# EAGLE design PPT_controller_flight1 (EAGLE 9.2.1)
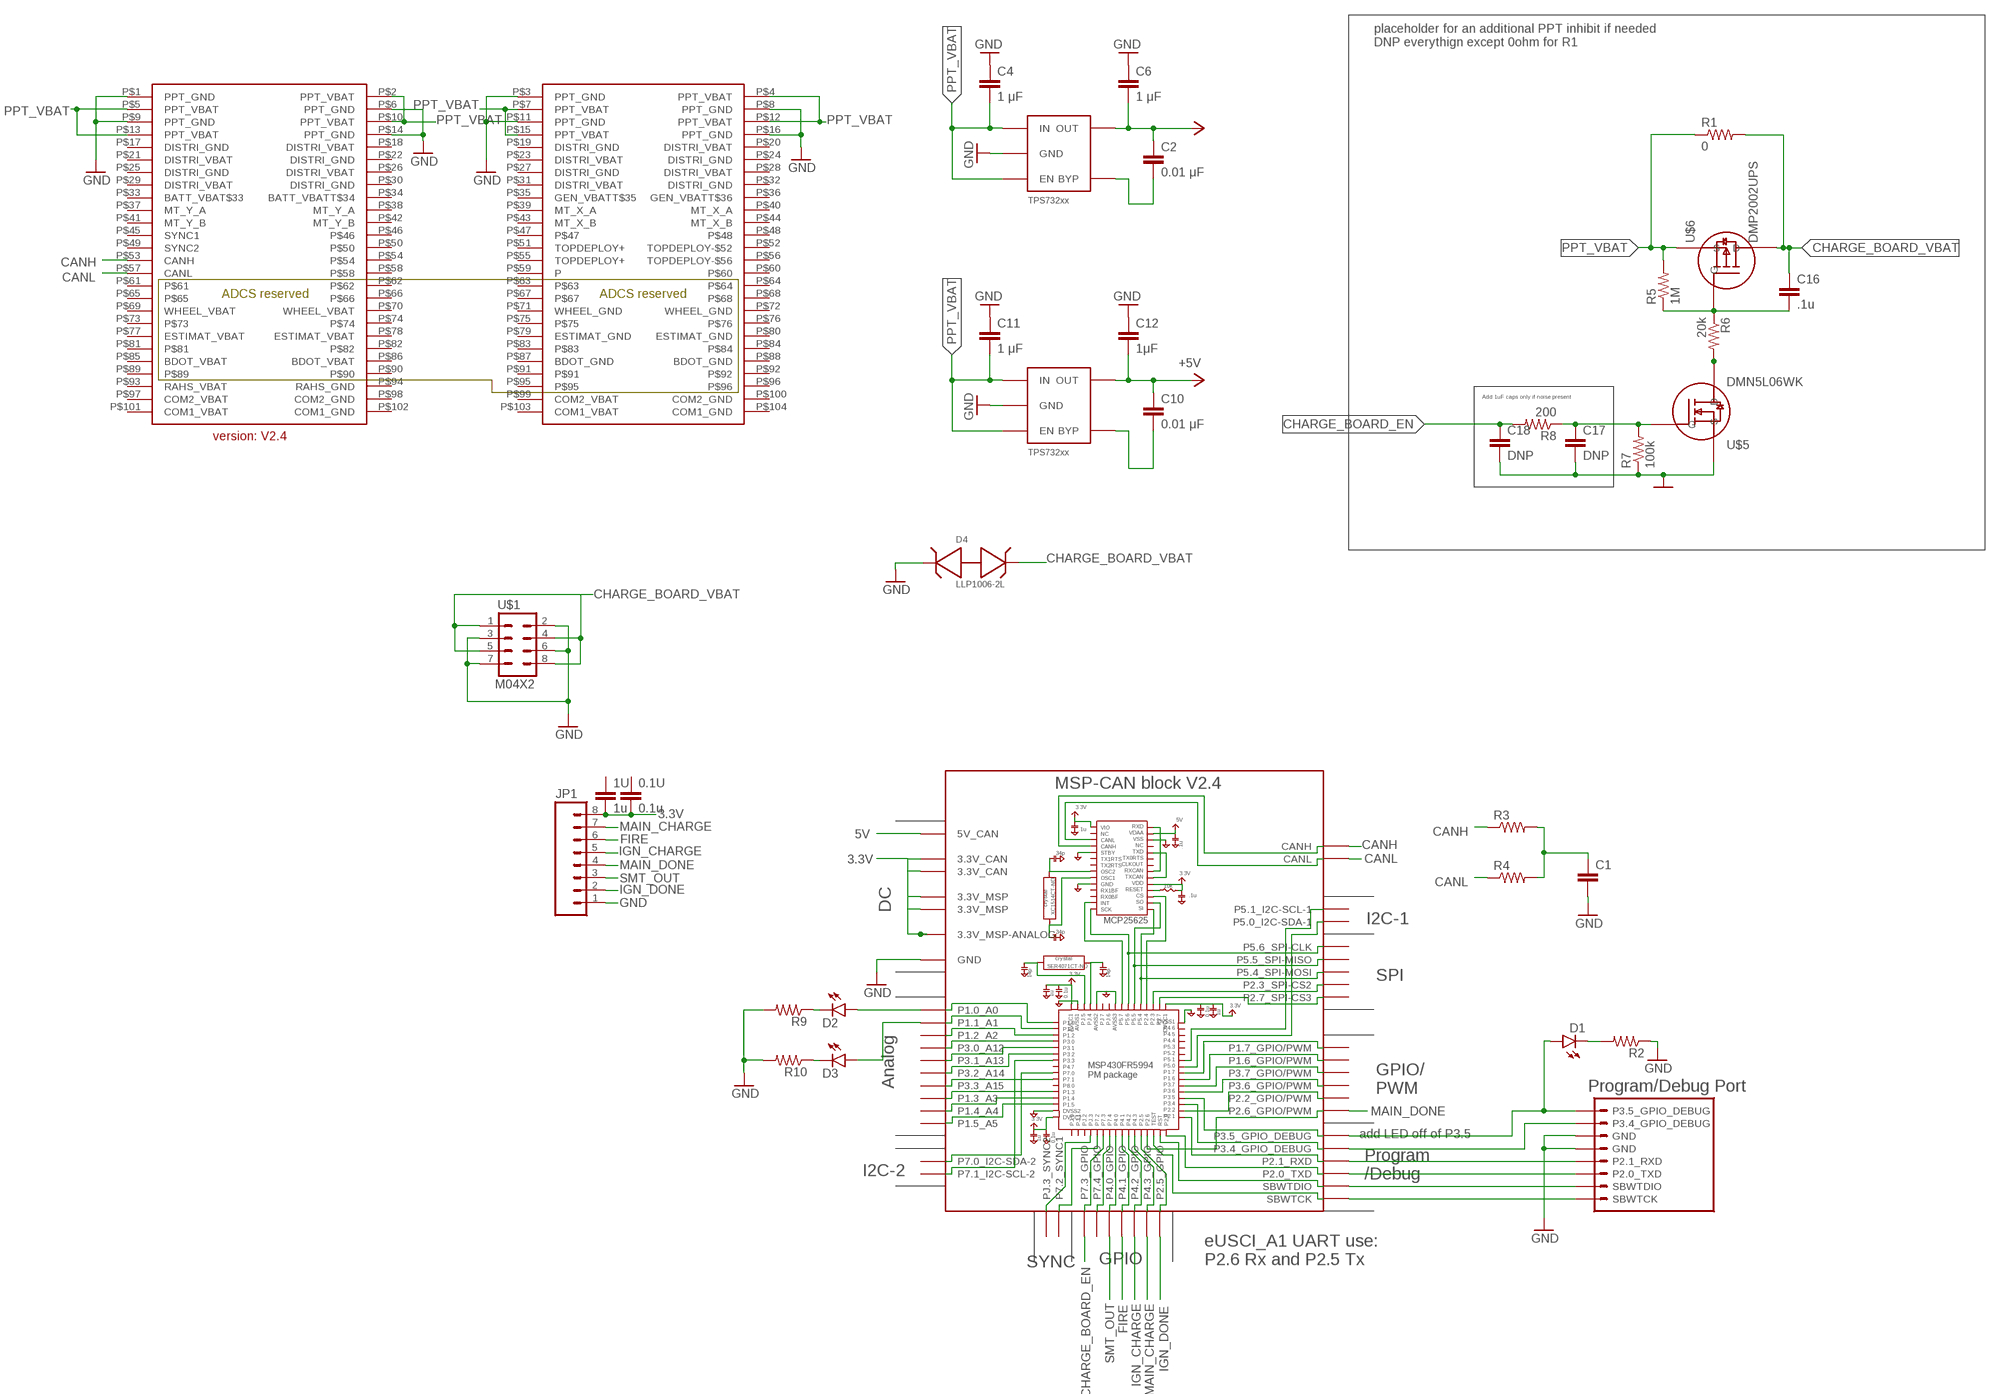
[diagram p0: schematic, sheet 1]

## Parts
0.1U  0.1u  CAPACITOR0805  [0805]
1U  1u  CAPACITOR0805  [0805]
BLK1  MSP-CAN_BLOCK  [MSP-CAN_BLOCK]
C1  CAPACITOR0805  [0805]
C2  0.01 μF  CAPACITOR0805  [0805]
C4  1 μF  CAPACITOR0805  [0805]
C6  1 μF  CAPACITOR0805  [0805]
C10  0.01 μF  CAPACITOR0805  [0805]
C11  1 μF  CAPACITOR0805  [0805]
C12  1μF  CAPACITOR0805  [0805]
C16  .1u  CAPACITOR0805  [0805]
C17  DNP  CAPACITOR0805  [0805]
C18  DNP  CAPACITOR0805  [0805]
D1  LED  [LED-1206]
D2  LED  [LED-1206]
D3  LED  [LED-1206]
D4  LLP1006-2L  [LLP1006-2L]
JP1  M08  [1X08_PIN1_NO_SILK]
R1  0  RESISTOR2010  [R2010]
R2  RESISTOR0805  [0805]
R3  RESISTOR0805  [0805]
R4  RESISTOR0805  [0805]
R5  1M  RESISTOR0805  [0805]
R6  20k  RESISTOR0805  [0805]
R7  100k  RESISTOR0805  [0805]
R8  200  RESISTOR0805  [0805]
R9  RESISTOR0805  [0805]
R10  RESISTOR0805  [0805]
U2  TPS732XX  [SOT-23-5]
U4  TPS732XX  [SOT-23-5]
U$1  M04X2  [2X4]
U$2  PC104_CONNECTOR  [PC104_CONNECTOR]
U$3  PROGRAM/DEBUG_PORT  [1X08_CONNECTOR]
U$5  DMN5L06WK  [SOT-323]
U$6  DMP2002UPS  [POWERDI5060-8]

## Nets
3.3V: 0.1U.2 1U.2 BLK1.3.3V@CAN1(3.3V_CAN) BLK1.3.3V@CAN2(3.3V_CAN) BLK1.3.3V@MSP1(3.3V_MSP) BLK1.3.3V@MSP2(3.3V_MSP) BLK1.3.3V_ANALOG@MSP2(3.3V_MSP-ANALOG) C2.1 C6.2 JP1.8 U2.P$5(OUT) ; supply symbol labelled +3V3
5V: BLK1.5V(5V_CAN) C10.1 C12.2 U4.P$5(OUT) ; supply symbol labelled +5V
CANH: BLK1.CANH R3.1 U$2.P$53(CANH)
CANL: BLK1.CANL R4.1 U$2.P$57(CANL)
CHARGE_BOARD_EN: BLK1.P7.3_GPIO C18.1 R8.2
CHARGE_BOARD_VBAT: C16.1 D4.P$2 R1.2 U$1.1 U$1.4 U$1.5 U$1.8 U$6.D1(D) U$6.D2(D) U$6.D3(D) U$6.D4(D) U$6.D5(D)
FIRE: BLK1.P4.1_GPIO JP1.6
GND: BLK1.GND@1(GND) BLK1.GND@2(GND) BLK1.GND@3(GND) BLK1.GND@4(GND) BLK1.GND@5(GND) BLK1.GND@7(GND) BLK1.GND@8(GND) BLK1.GND@9(GND) BLK1.GND@10(GND) BLK1.GND@11(GND) BLK1.GND@12(GND) BLK1.GND@13(GND) BLK1.GND@14(GND) BLK1.GND@15(GND) BLK1.GND@16(GND) BLK1.GND@17(GND) BLK1.GND@26(GND) C1.2 C4.1 C6.1 C11.1 C12.1 C17.2 C18.2 D4.P$1 JP1.1 R2.1 R7.1 R9.2 R10.2 U2.P$2(GND) U4.P$2(GND) U$1.2 U$1.3 U$1.6 U$1.7 U$2.P$1(PPT_GND) U$2.P$3(PPT_GND) U$2.P$6(PPT_GND) U$2.P$8(PPT_GND) U$2.P$9(PPT_GND) U$2.P$11(PPT_GND) U$2.P$14(PPT_GND) U$2.P$16(PPT_GND) U$3.5(GND) U$3.6(GND) U$5.2(S) ; supply symbol labelled DGND
IGN_CHARGE: BLK1.P4.2_GPIO JP1.5
IGN_DONE: BLK1.P2.5_GPIO JP1.2
LDO_3V3_BYP2: C2.2 U2.P$4(BYP)
LDO_5V_BYP2: C10.2 U4.P$4(BYP)
MAIN_CHARGE: BLK1.P4.3_GPIO JP1.7
MAIN_DONE: BLK1.P2.6_GPIO/PWM JP1.4
N$1: C16.2 R5.1 R6.1 U$6.G
N$2: C17.1 R7.2 R8.1 U$5.1(G)
N$3: BLK1.SBWTCK U$3.SBWTCK
N$4: BLK1.SBWTDIO U$3.2(SBWTDIO)
N$5: BLK1.P2.0_TXD U$3.3(P2.0_TXD)
N$6: R6.2 U$5.3(D)
N$7: BLK1.P2.1_RXD U$3.4(P2.1_RXD)
N$8: BLK1.P3.4_GPIO_DEBUG U$3.7(P3.4_GPIO_DEBUG)
N$9: BLK1.P3.5_GPIO_DEBUG D1.A U$3.8(P3.5_GPIO_DEBUG)
N$10: C1.1 R3.2 R4.2
N$11: D1.C R2.2
N$12: BLK1.P1.0_A0 D2.A
N$13: BLK1.P1.1_A1 D3.A
N$14: D3.C R10.1
N$15: D2.C R9.1
PPT_VBAT: C4.2 C11.2 R1.1 R5.2 U2.P$1(IN) U2.P$3(EN) U4.P$1(IN) U4.P$3(EN) U$2.P$2(PPT_VBAT) U$2.P$4(PPT_VBAT) U$2.P$5(PPT_VBAT) U$2.P$7(PPT_VBAT) U$2.P$10(PPT_VBAT) U$2.P$12(PPT_VBAT) U$2.P$13(PPT_VBAT) U$2.P$15(PPT_VBAT) U$6.S1(S) U$6.S2(S) U$6.S3(S)
SMT_OUT: BLK1.P4.0_GPIO JP1.3
Unconnected: 0.1U.1 1U.1 BLK1.P1.2_A2 BLK1.P1.3_A3 BLK1.P1.4_A4 BLK1.P1.5_A5 BLK1.P1.6_GPIO/PWM BLK1.P1.7_GPIO/PWM BLK1.P2.2_GPIO/PWM BLK1.P2.4_SPI-CS2(P2.3_SPI-CS2) BLK1.P2.7_SPI-CS3 BLK1.P3.0_A12 BLK1.P3.1_A13 BLK1.P3.2_A14 BLK1.P3.3_A15 BLK1.P3.6_GPIO/PWM BLK1.P3.7_GPIO/PWM BLK1.P5.0_I2C-SDA-1 BLK1.P5.1_I2C-SCL-1 BLK1.P5.4_SPI-MOSI BLK1.P5.5_SPI-MISO BLK1.P5.6_SPI-CLK BLK1.P7.0_I2C-SDA-2 BLK1.P7.1_I2C-SCL-2 BLK1.P7.2_SYNC1 BLK1.P7.4_GPIO BLK1.PJ.3_SYNC2 U$2.P$17(DISTRI_GND) U$2.P$18(DISTRI_VBAT) U$2.P$19(DISTRI_GND) U$2.P$20(DISTRI_VBAT) U$2.P$21(DISTRI_VBAT) U$2.P$22(DISTRI_GND) U$2.P$23(DISTRI_VBAT) U$2.P$24(DISTRI_GND) U$2.P$25(DISTRI_GND) U$2.P$26(DISTRI_VBAT) U$2.P$27(DISTRI_GND) U$2.P$28(DISTRI_VBAT) U$2.P$29(DISTRI_VBAT) U$2.P$30(DISTRI_GND) U$2.P$31(DISTRI_VBAT) U$2.P$32(DISTRI_GND) U$2.P$33(BATT_VBAT$33) U$2.P$34(BATT_VBATT$34) U$2.P$35(GEN_VBATT$35) U$2.P$36(GEN_VBATT$36) U$2.P$37(MT_Y_A) U$2.P$38(MT_Y_A) U$2.P$39(MT_X_A) U$2.P$40(MT_X_A) U$2.P$41(MT_Y_B) U$2.P$42(MT_Y_B) U$2.P$43(MT_X_B) U$2.P$44(MT_X_B) U$2.P$45(SYNC1) U$2.P$46 U$2.P$47 U$2.P$48 U$2.P$49(SYNC2) U$2.P$50 U$2.P$51(TOPDEPLOY+) U$2.P$52(TOPDEPLOY-$52) U$2.P$54 U$2.P$55(TOPDEPLOY+) U$2.P$56(TOPDEPLOY-$56) U$2.P$58 U$2.P$59(P) U$2.P$60 U$2.P$61 U$2.P$62 U$2.P$63 U$2.P$64 U$2.P$65 U$2.P$66 U$2.P$67 U$2.P$68 U$2.P$69(WHEEL_VBAT) U$2.P$70(WHEEL_VBAT) U$2.P$71(WHEEL_GND) U$2.P$72(WHEEL_GND) U$2.P$73 U$2.P$74 U$2.P$75 U$2.P$76 U$2.P$77(ESTIMAT_VBAT) U$2.P$78(ESTIMAT_VBAT) U$2.P$79(ESTIMAT_GND) U$2.P$80(ESTIMAT_GND) U$2.P$81 U$2.P$82 U$2.P$83 U$2.P$84 U$2.P$85(BDOT_VBAT) U$2.P$86(BDOT_VBAT) U$2.P$87(BDOT_GND) U$2.P$88(BDOT_GND) U$2.P$89 U$2.P$90 U$2.P$91 U$2.P$92 U$2.P$93(RAHS_VBAT) U$2.P$94(RAHS_GND) U$2.P$95 U$2.P$96 U$2.P$97(COM2_VBAT) U$2.P$98(COM2_GND) U$2.P$99(COM2_VBAT) U$2.P$100(COM2_GND) U$2.P$101(COM1_VBAT) U$2.P$102(COM1_GND) U$2.P$103(COM1_VBAT) U$2.P$104(COM1_GND)

## Notes on the sheet
- placeholder for an additional PPT inhibit if needed
  DNP everythign except 0ohm for R1
- Add 1uF caps only if noise present

## Library data of the parts
0.1U 1U C1 C2 C4 C6 C10-C12 C16-C18 = DubSat1 Components:CAPACITOR: Capacitor Standard 0603 ceramic capacitor, and 0.1" leaded capacitor.
BLK1 = DubSat1 Components:MSP-CAN_BLOCK
D1-D3 = DubSat1 Components:LED
D4 = DubSat1 Components:LLP1006-2L: A LLP1006-2L diode
JP1 = SparkFun-Connectors:M08: Header 8 Standard 8-pin 0.1" header. Use with straight break away headers (SKU : PRT-00116), right angle break away headers (PRT-00553), swiss pins (PRT-00743), machine pins (PRT-00117), and female headers (PRT-00115).
R1-R10 = DubSat1 Components:RESISTOR: Resistor Basic schematic elements and footprints for 0603, 1206, and PTH resistors.
U2 U4 = DubSat1 Components:TPS732XX
U$1 = SparkFun-Connectors:M04X2: .1" header, two rows of four.
U$2 = DubSat1 Components:PC104_CONNECTOR
U$3 = DubSat1 Components:PROGRAM/DEBUG_PORT
U$5 = DubSat1 Components:DMN5L06WK
U$6 = DubSat1 Components:DMP2002UPS

## Board
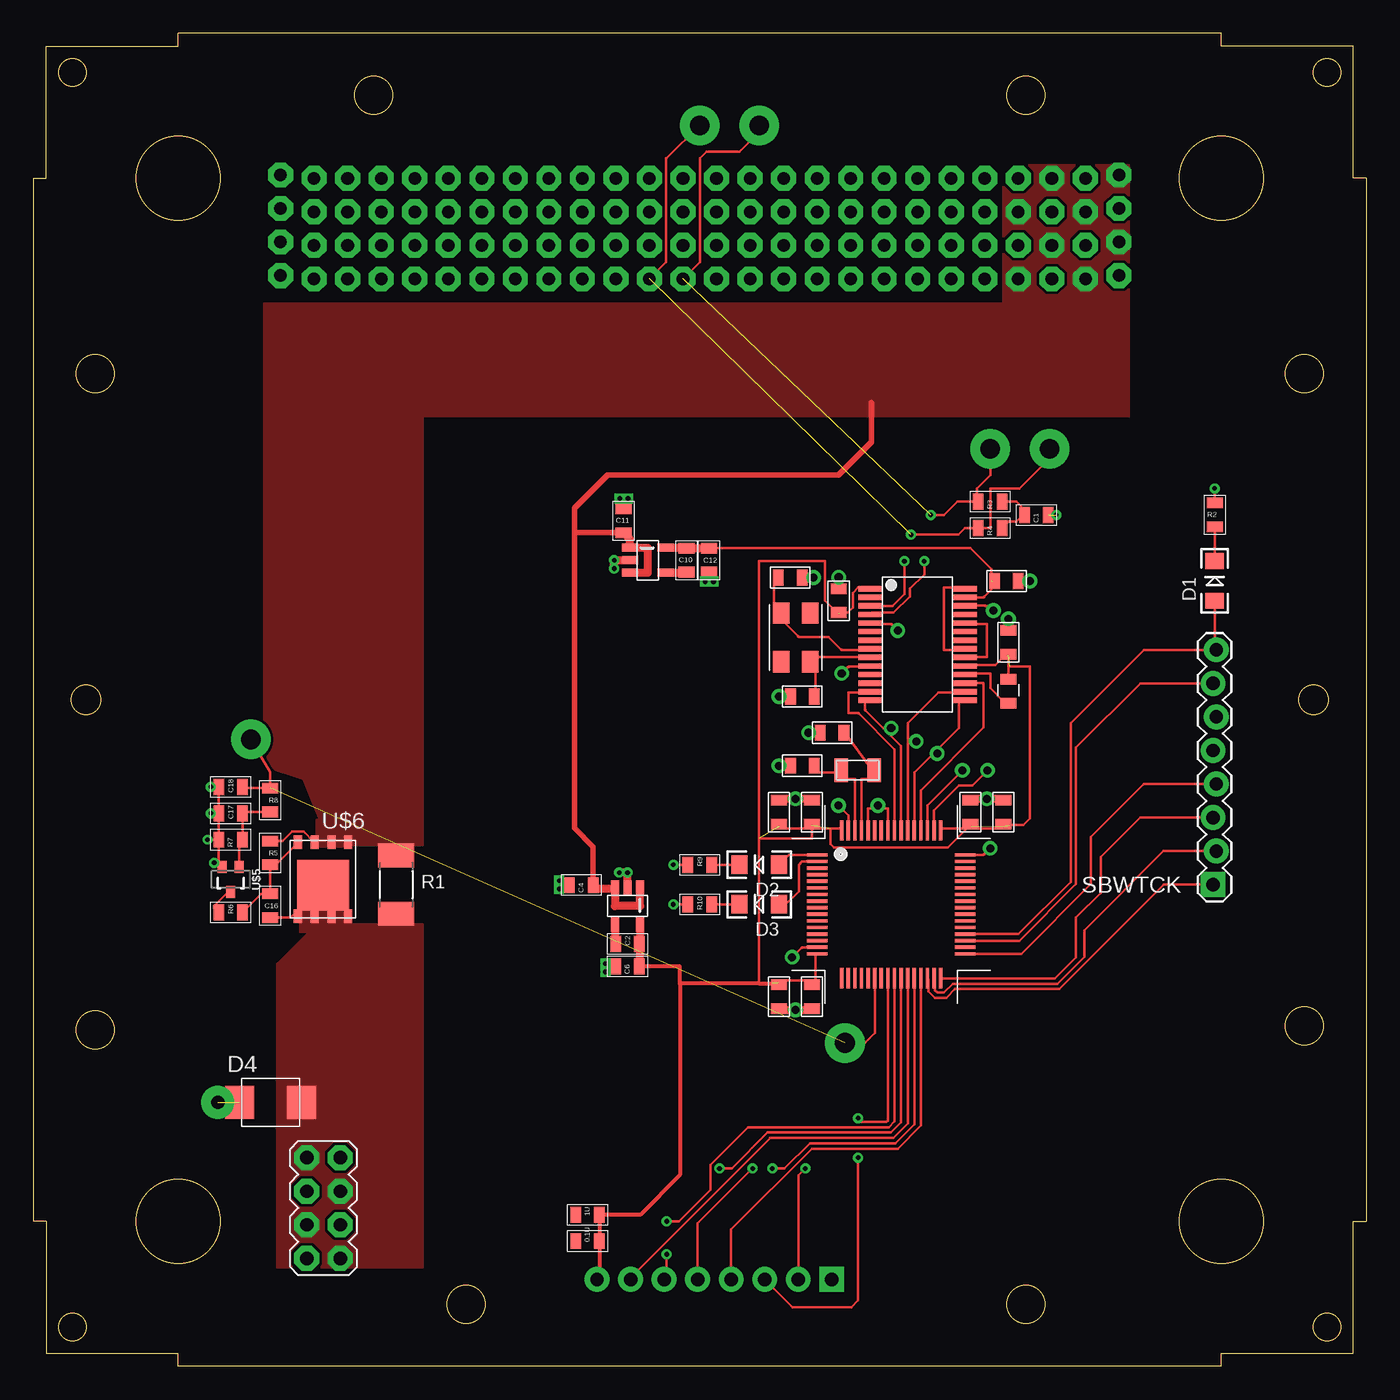
[diagram p1: board, top side]
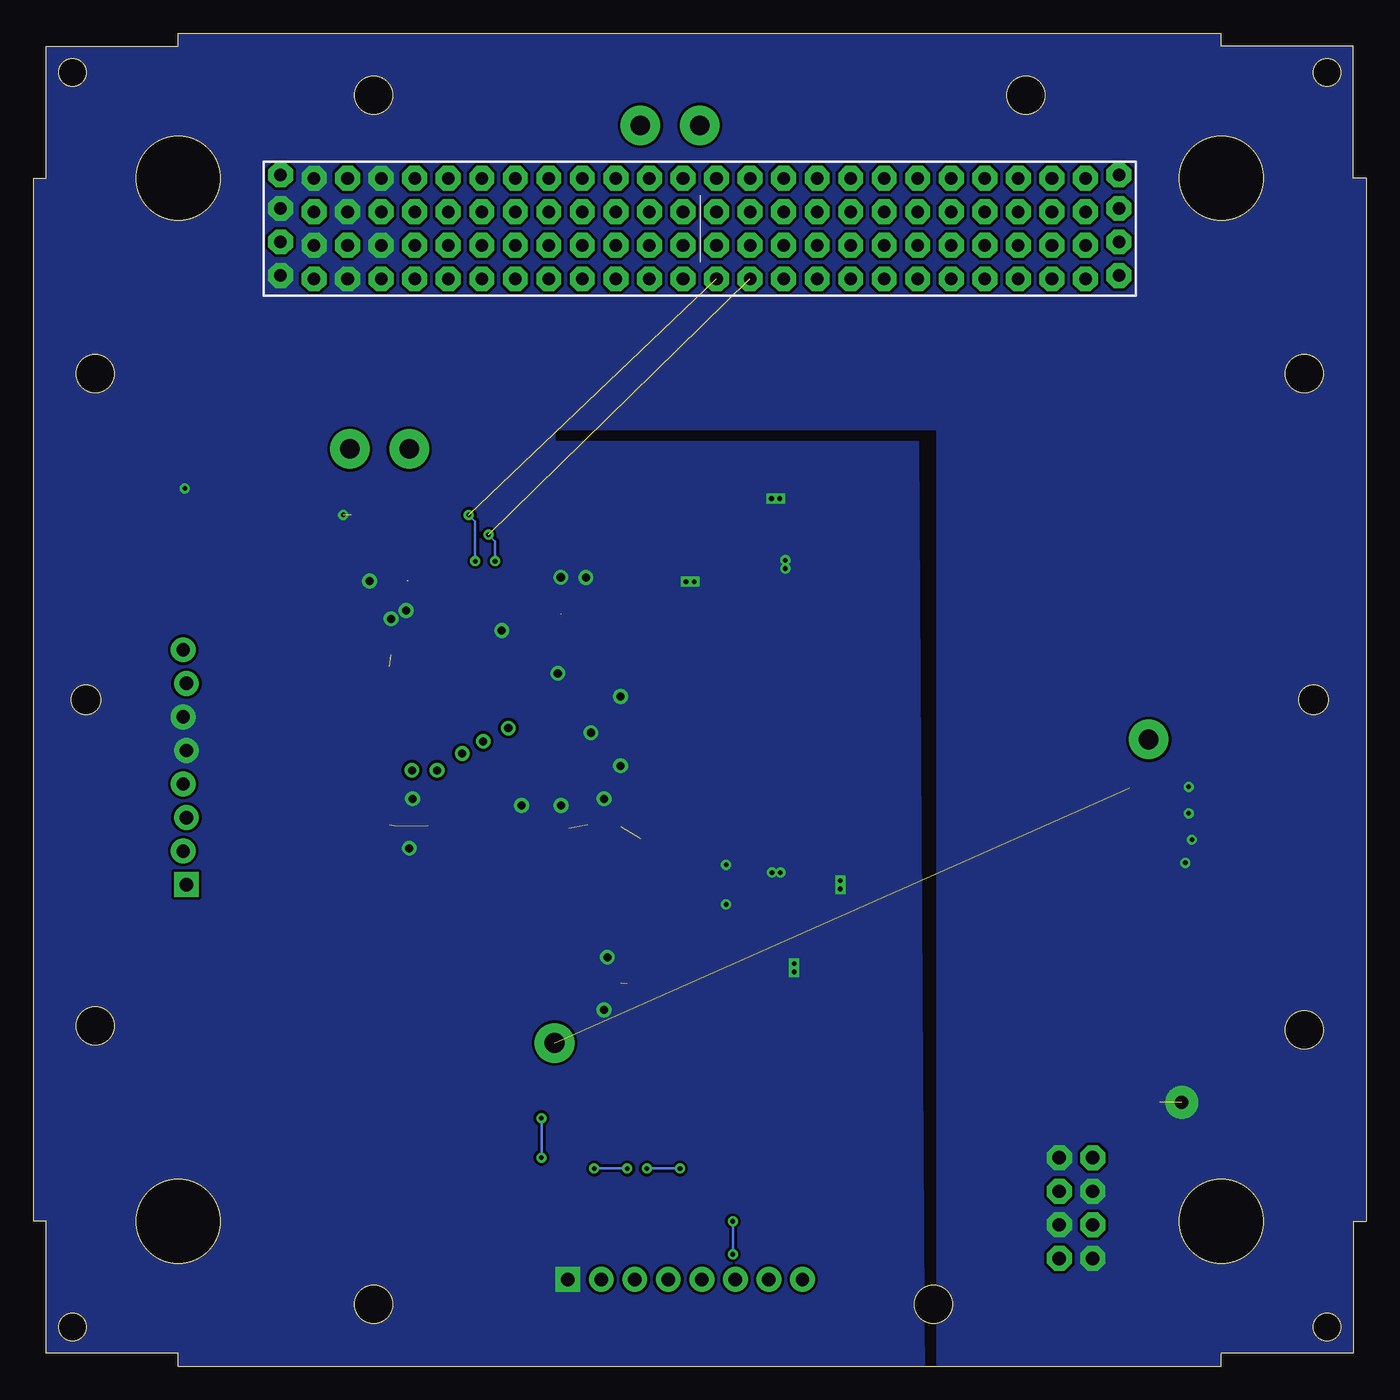
[diagram p2: board, bottom side, seen from below]

Size 101 x 101 mm. Coordinates in mm from the lower left corner, seen from the top.
Outline: 90,101 11,101 11,100 1,100 1,90 0,90 0,11 1,11 1,1 11,1 11,0 90,0 90,1 100,1 100,11 101,11 101,90 100,90 100,100 90,100 90,101
Outline: circle at 4.7,25.5 radius 1.45
Outline: circle at 32.8,4.7 radius 1.45
Outline: circle at 75.2,4.7 radius 1.45
Outline: circle at 96.3,25.8 radius 1.45
Outline: circle at 96.3,75.2 radius 1.45
Outline: circle at 75.2,96.3 radius 1.45
Outline: circle at 25.8,96.3 radius 1.45
Outline: circle at 4.7,75.2 radius 1.45
Outline: circle at 4,50.5 radius 1.13
Outline: circle at 97,50.5 radius 1.13
Outline: circle at 3,98 radius 1.05
Outline: circle at 3,3 radius 1.05
Outline: circle at 98,3 radius 1.05
Outline: circle at 98,98 radius 1.05
Outline: circle at 90,11 radius 3.17
Outline: circle at 11,11 radius 3.17
Outline: circle at 11,90 radius 3.17
Outline: circle at 90,90 radius 3.17
Copper layers (1*16): Top 0.035mm / dielectric 1.5mm / Bottom 0.035mm
Design rules "default *": minimum track width 6mil, minimum drill 0.35mm, track to track 8mil, track to pad 8mil, pad to pad 8mil, via to via 8mil, smd to smd 8mil, copper to edge 1mil, drill to drill 8mil, minimum pad ring 10mil, minimum via ring 8mil, stop-mask expansion 4mil, vias tented up to drill 0mil, thermal gap 10mil

### Footprints (pad centres in the part's own frame; a part is rotated, then mirrored left to right if it is on the bottom)
0805 = smd 0.8 x 1.2: 1 -0.9,0; 2 0.9,0
MSP-CAN_BLOCK = smd 1.2 x 0.8: 1 -6,6.08; 2 -6,7.88; 3 -8.5,6.08; 4 -8.5,7.88; 9 -8.5,-6.08; 10 -8.5,-7.88; 11 -6,-6.08; 12 -6,-7.88; 13 8.5,6.08; 14 8.5,7.88; 15 6,6.08; 16 6,7.88; 23 8.875,18.955; 24 8.875,20.755; 25 8.875,17.045; 26 8.875,15.245; 27 -3.975,22.105; 28 -3.975,23.905 | smd 1 x 0.25: 3.3V@CAN1 -3.975,22.025; 3.3V@CAN2 8.875,18.875; 3.3V@MSP1 8.501,5.884; 3.3V@MSP2 -8.533,-5.962; 3.3V_ANALOG@MSP2 -8.482,5.904 | smd 0.8 x 1.2: 5 -5.83,10.5; 6 -7.63,10.5; 7 -3.58,13; 8 -5.38,13; 17 -8.545,24.75; 18 -6.745,24.75; 19 -5.83,15.75; 20 -7.63,15.75; 21 7.83,24.5; 22 9.63,24.5 | smd 0.25 x 1: 5V 7.65,24.5 | smd 1.75 x 0.4: CANH -1.6,21.96; CANL -1.6,22.61; P$65 -1.6,23.91; P$66 -1.6,23.26; P$69 -1.6,21.31; P$70 -1.6,20.66; P$71 -1.6,20.01; P$72 -1.6,19.36; P$73 -1.6,18.71; P$74 -1.6,18.06; P$75 -1.6,17.41; P$76 -1.6,16.76; P$77 -1.6,16.11; P$78 -1.6,15.46; P$79 5.6,15.46; P$80 5.6,16.11; P$81 5.6,16.76; P$82 5.6,17.41; P$83 5.6,18.06; P$84 5.6,18.71; P$85 5.6,19.36; P$86 5.6,20.01; P$87 5.6,20.66; P$88 5.6,21.31; P$89 5.6,21.96; P$90 5.6,22.61; P$91 5.6,23.26; P$92 5.6,23.91 | drill 0.61: GND@1 -3.975,24.775; GND@2 -5.875,24.75; GND@3 -3.75,17.5; GND@4 0.5,20.75; GND@5 -8.5,15.75; GND@7 -8.5,10.5; GND@8 -7.25,8; GND@9 -4,7.5; GND@10 -1,7.5; GND@11 7.75,22.25; GND@12 10.5,24.5; GND@13 8.875,21.625; GND@14 7.25,8; GND@15 7.5,4.25; GND@16 -7.5,-4; GND@17 -7.25,-8; GND@26 -6.25,13; P2.4_SPI-CS2 5.397,10.16; P2.7_SPI-CS3 7.303,10.16; P5.4_SPI-MOSI 3.487,11.434; P5.5_SPI-MISO 1.9,12.354; P5.6_SPI-CLK 0,13.348 | smd 1.55 x 0.25: P1.0_A0 -5.6,3.75; P1.1_A1 -5.6,3.25; P1.2_A2 -5.6,2.75; P1.3_A3 -5.6,-1.75; P1.4_A4 -5.6,-2.25; P1.5_A5 -5.6,-2.75; P1.6_GPIO/PWM 5.6,-0.75; P1.7_GPIO/PWM 5.6,-0.25; P2.1_RXD 5.6,-3.75; P2.2_GPIO/PWM 5.6,-3.25; P3.0_A12 -5.6,2.25; P3.1_A13 -5.6,1.75; P3.2_A14 -5.6,1.25; P3.3_A15 -5.6,0.75; P3.4_GPIO_DEBUG 5.6,-2.75; P3.5_GPIO_DEBUG 5.6,-2.25; P3.6_GPIO/PWM 5.6,-1.75; P3.7_GPIO/PWM 5.6,-1.25; P5.0_I2C-SDA-1 5.6,0.25; P5.1_I2C-SCL-1 5.6,0.75; P7.0_I2C-SDA-2 -5.6,-0.25; P7.1_I2C-SCL-2 -5.6,-0.75; P$8 -5.6,0.25; P$11 -5.6,-1.25; P$15 -5.6,-3.25; P$16 -5.6,-3.75; P$43 5.6,1.25; P$44 5.6,1.75; P$45 5.6,2.25; P$46 5.6,2.75; P$47 5.6,3.25; P$48 5.6,3.75 | smd 0.25 x 1.55: P2.0_TXD 3.75,-5.6; P2.5_GPIO 1.75,-5.6; P2.6_GPIO/PWM 2.25,-5.6; P4.0_GPIO -0.25,-5.6; P4.1_GPIO 0.25,-5.6; P4.2_GPIO 0.75,-5.6; P4.3_GPIO 1.25,-5.6; P7.2_SYNC1 -1.75,-5.6; P7.3_GPIO -1.25,-5.6; P7.4_GPIO -0.75,-5.6; P$17 -3.75,-5.6; P$18 -3.25,-5.6; P$19 -2.75,-5.6; P$49 3.75,5.6; P$50 3.25,5.6; P$51 2.75,5.6; P$52 2.25,5.6; P$53 1.75,5.6; P$54 1.25,5.6; P$55 0.75,5.6; P$56 0.25,5.6; P$57 -0.25,5.6; P$58 -0.75,5.6; P$59 -1.25,5.6; P$60 -1.75,5.6; P$61 -2.25,5.6; P$62 -2.75,5.6; P$63 -3.25,5.6; P$64 -3.75,5.6; PJ.3_SYNC2 -2.25,-5.6; SBWTCK 2.75,-5.6; SBWTDIO 3.25,-5.6 | smd 1 x 1.8: P$93 -3.79,10.16; P$94 -1.29,10.16 | smd 1.25 x 1.6: P$104 -6.13,18.38; P$105 -6.13,22.08; P$106 -8.33,22.08; P$107 -8.33,18.38
LED-1206 = smd 1.2 x 1.4: A -1.5,0; C 1.5,0
LLP1006-2L = smd 2.2 x 2.5: P$1 -2.35,0; P$2 2.35,0
1X08_PIN1_NO_SILK = drill 1.016 pad 1.88 square: 1 0,0 | drill 1.016 pad 1.88: 2 2.54,0; 3 5.08,0; 4 7.62,0; 5 10.16,0; 6 12.7,0; 7 15.24,0; 8 17.78,0
R2010 = smd 1.8 x 2.7: 1 -2.2,0; 2 2.2,0
SOT-23-5 = smd 0.6 x 1.2: P$1 -0.95,-1.35; P$2 0,-1.35; P$3 0.95,-1.35; P$4 0.95,1.35; P$5 -0.95,1.35
2X4 = drill 1.016 pad 1.88 octagon: 1 -3.81,-1.27; 2 -3.81,1.27; 3 -1.27,-1.27; 4 -1.27,1.27; 5 1.27,-1.27; 6 1.27,1.27; 7 3.81,-1.27; 8 3.81,1.27
PC104_CONNECTOR = drill 0.953 pad 1.88 octagon: P$1 -31.75,32.134; P$2 -31.75,34.674; P$3 -31.75,37.214; P$4 -31.75,39.754; P$5 -29.21,31.88; P$6 -29.21,34.42; P$7 -29.21,36.96; P$8 -29.21,39.5; P$9 -26.67,31.88; P$10 -26.67,34.42; P$11 -26.67,36.96; P$12 -26.67,39.5; P$13 -24.13,31.88; P$14 -24.13,34.42; P$15 -24.13,36.96; P$16 -24.13,39.5; P$17 -21.59,31.88; P$18 -21.59,34.42; P$19 -21.59,36.96; P$20 -21.59,39.5; P$21 -19.05,31.88; P$22 -19.05,34.42; P$23 -19.05,36.96; P$24 -19.05,39.5; P$25 -16.51,31.88; P$26 -16.51,34.42; P$27 -16.51,36.96; P$28 -16.51,39.5; P$29 -13.97,31.88; P$30 -13.97,34.42; P$31 -13.97,36.96; P$32 -13.97,39.5; P$33 -11.43,31.88; P$34 -11.43,34.42; P$35 -11.43,36.96; P$36 -11.43,39.5; P$37 -8.89,31.88; P$38 -8.89,34.42; P$39 -8.89,36.96; P$40 -8.89,39.5; P$41 -6.35,31.88; P$42 -6.35,34.42; P$43 -6.35,36.96; P$44 -6.35,39.5; P$45 -3.81,31.88; P$46 -3.81,34.42; P$47 -3.81,36.96; P$48 -3.81,39.5; P$49 -1.27,31.88; P$50 -1.27,34.42; P$51 -1.27,36.96; P$52 -1.27,39.5; P$53 1.27,31.88; P$54 1.27,34.42; P$55 1.27,36.96; P$56 1.27,39.5; P$57 3.81,31.88; P$58 3.81,34.42; P$59 3.81,36.96; P$60 3.81,39.5; P$61 6.35,31.88; P$62 6.35,34.42; P$63 6.35,36.96; P$64 6.35,39.5; P$65 8.89,31.88; P$66 8.89,34.42; P$67 8.89,36.96; P$68 8.89,39.5; P$69 11.43,31.88; P$70 11.43,34.42; P$71 11.43,36.96; P$72 11.43,39.5; P$73 13.97,31.88; P$74 13.97,34.42; P$75 13.97,36.96; P$76 13.97,39.5; P$77 16.51,31.88; P$78 16.51,34.42; P$79 16.51,36.96; P$80 16.51,39.5; P$81 19.05,31.88; P$82 19.05,34.42; P$83 19.05,36.96; P$84 19.05,39.5; P$85 21.59,31.88; P$86 21.59,34.42; P$87 21.59,36.96; P$88 21.59,39.5; P$89 24.13,31.88; P$90 24.13,34.42; P$91 24.13,36.96; P$92 24.13,39.5; P$93 26.67,31.88; P$94 26.67,34.42; P$95 26.67,36.96; P$96 26.67,39.5; P$97 29.21,31.88; P$98 29.21,34.42; P$99 29.21,36.96; P$100 29.21,39.5; P$101 31.75,32.134; P$102 31.75,34.674; P$103 31.75,37.214; P$104 31.75,39.754
1X08_CONNECTOR = drill 1.016 pad 1.88: 2 2.54,-0.127; 3 5.08,0.127; 4 7.62,-0.127; 5 10.16,0.127; 6 12.7,-0.127; 7 15.24,0.127; 8 17.78,-0.127 | drill 1.016 pad 1.88 square: SBWTCK 0,0.127
SOT-323 = smd 0.7 x 0.9: 1 -0.65,-0.95; 2 0.65,-0.95; 3 0,0.95
POWERDI5060-8 = smd 3.91 x 3.81: D1 0,0.44 | smd 0.61 x 1.02: D2 -1.905,2.795; D3 -0.635,2.795; D4 0.635,2.795; D5 1.905,2.795; G 1.905,-2.795; S1 -1.905,-2.795; S2 -0.635,-2.795; S3 0.635,-2.795

### Placement (x,y rotation side)
0.1U  42,11.5 0 top
1U  42,9.5 0 top
BLK1  65,35 0 top
C1  76,64.5 0 top
C2  45.03,32.02 180 top
C4  41.53,36.46 0 top
C6  45.03,30.3 0 top
C10  49.49,61.07 270 top
C11  44.72,64.06 270 top
C12  51.2,61.07 90 top
C16  17.97,34.9 90 top
C17  14.97,41.9 180 top
C18  14.97,43.9 180 top
D1  89.5,59.5 90 top
D2  55,38 180 top
D3  55,35 180 top
D4  18,20 0 top
JP1  60.5,6.6 180 top
R1  27.5,36.5 270 top
R2  89.5,64.5 270 top
R3  72.5,65.5 0 top
R4  72.5,63.5 0 top
R5  17.97,38.9 90 top
R6  14.97,34.4 180 top
R7  14.97,39.9 0 top
R8  17.97,42.9 90 top
R9  50.5,38 180 top
R10  50.5,35 180 top
U2  45.03,34.87 180 top
U4  46.56,61.07 270 top
U$1  22,12 90 top
U$2  50.5,50.5 0 bottom
U$3  89.5,36.5 90 top
U$5  14.97,36.9 180 top
U$6  21.97,36.9 180 top

### Tracks (layer width: path | path; a pad name or v marks a point on that pad's centre or on a via)
3.3V  (7 unrouted)
  Top 0.203: 55,29 55,40 | 55,40 55,61 60,61 60,58 61,57 | 55,40 59,40 59,41 | 74,41 75,41 75.5,41.5 75.5,53 74,53 | 60.38,40.75 60.38,39.59 60.67,39.3 69.31,39.3 70.83,40.83 71.08,40.95 | 42.9,6.78 JP1.8
  Top 0.305: 46.13,30.1 C6.2 49,30.3 49,29 | 56,29 55,29 49,29 | 42.9,6.78 1U.2 0.1U.2 46,11.5 49,14.5 49,29
  Top 0.61: C6.2 C2.1 45.98,32.07 U2.P$5
5V  (1 unrouted)
  Top 0.203: 72.61,59.49 72.61,60.39 71,62 51.5,62 51.36,62.14 | C12.2 51.36,62.14 | 51.36,62.14 51.5,62.27
  Top 0.61: 51.2,62.02 C12.2 C10.1 49.44,62.02 U4.P$5
CANH  (via drill 0.35, 1.5 pad 3)  (1 unrouted)
  Top 0.203: BLK1.CANH 63.55,57.11 65.18,57.11 66.41,58.33 66.41,58.91 67.5,60 v67.5,61 | R3.1 71.5,65.5 | 71.5,65.5 70,65.5 69,64.5 v68,64.5 | 71.5,65.5 71.5,66.5 72.5,67.5 v72.5,69.5 | U$2.P$53 50.5,83.65 50.5,91.5 51,92 53.5,92 55,93.5 v55,94
  Bottom 0.203: v68,64.5 67.5,64 v67.5,61
CANL  (via drill 0.35, 1.5 pad 3)  (1 unrouted)
  Top 0.203: BLK1.CANL 65.11,57.61 66,58.5 v66,61 | 71.9,63.8 R4.1 | R4.1 70.6,63.5 70.1,63 v66.5,63 | R4.1 72.5,63.5 72.5,66.5 74.71,66.5 77,68.79 v77,69.5 | U$2.P$57 47.96,83.65 47.96,91.5 48,91.5 v50.5,94
  Bottom 0.203: v66.5,63 66,62.5 v66,61
CHARGE_BOARD_EN  (via drill 1.5 pad 3)  (1 unrouted)
  Top 0.203: C18.1 15.97,43.8 R8.2 17.97,45.03 v16.5,47.5 | BLK1.P7.3_GPIO 63.75,25.25 63,24.5 v61.5,24.5
CHARGE_BOARD_VBAT
  Top 0.2: C16.1 19.51,34 U$6.D1
  pour Top (no thermals): 23.72,34.9 23.72,32.9 20.22,32.9 20.22,34.9
  pour Top (no thermals): 18.5,7.5 18.5,30.5 21.5,33.5 29.5,33.5 29.5,7.5
FIRE  (via drill 0.35)
  Top 0.203: BLK1.P4.1_GPIO 65.25,18.55 64.83,18.13 54.16,18.13 51.32,15.28 51.32,13.39 48.92,11 v48,11 | v48,8.5 48,6.8 JP1.6
  Bottom 0.203: v48,11 v48,8.5
GND  (via drill 0.35, 1 pad 2.5)  (2 unrouted)
  Top 0.203: v13.47,43.9 C18.2 C17.2 | v13.47,41.9 C17.2 | v13.22,39.9 R7.1 | v13.72,38.15 14.02,37.85 U$5.2 14.07,38.1 R7.1 | C17.2 R7.1 | R2.1 v89.5,66.5 | R9.2 v48.5,38 | R10.2 v48.5,35
  Top 0.61: U2.P$2 v45.03,37.41 v44.39,37.41 | v43.35,29.88 43.77,30.3 C6.1 43.91,30.52 v43.35,30.52 | v39.86,36.17 40.34,36.17 C4.1 40.2,36.46 v39.86,36.81 | U4.P$2 v44.02,61.07 v44.02,60.44 | v50.91,59.45 51.2,59.74 C12.1 51.2,59.79 v51.55,59.45 | v44.43,65.73 44.43,65.3 C11.1 44.72,65.39 v45.07,65.73
  other vias: 77.5,64.5 14,20
  pour Bottom (no thermals): 32.5,71 32.5,-1.5 -0.5,-1.5 -0.5,103.5 103.5,103.5 103.5,-1.5 33.51,-1.5 33.99,70 61.5,70 61.5,71
IGN_CHARGE  (via drill 0.35)
  Top 0.203: BLK1.P4.2_GPIO 65.75,18.47 65,17.72 55.64,17.72 52.92,15 v52,15 | v54.5,15 50.34,10.84 JP1.5
  Bottom 0.203: v54.5,15 v52,15
IGN_DONE  (via drill 0.35)
  Top 0.203: BLK1.P2.5_GPIO 66.75,18.33 65.33,16.91 58.83,16.91 56.92,15 v56,15 | v58.5,15 57.96,14.46 JP1.2
  Bottom 0.203: v56,15 v58.5,15
LDO_3V3_BYP2
  Top 0.61: U2.P$4 44.08,32.07 C2.2
LDO_5V_BYP2
  Top 0.61: U4.P$4 49.44,60.12 C10.2
MAIN_CHARGE
  Top 0.203: BLK1.P4.3_GPIO 66.25,18.4 65.16,17.31 55.85,17.31 | 55.85,17.31 55.81,17.31 | 55.85,17.31 45.26,6.73 JP1.7
MAIN_DONE
  Top 0.203: BLK1.P2.6_GPIO/PWM 67.25,18.25 65.5,16.5 59,16.5 52.88,10.38 JP1.4
N$1
  Top 0.2: R5.1 C16.2
  Top 0.203: U$6.G 18.37,38 R5.1 | C16.2 17.27,35.8 R6.1
N$2
  Top 0.203: U$5.1 15.62,39.65 R7.2 C17.1 15.97,42 R8.1
N$3
  Top 0.203: BLK1.SBWTCK 67.82,29.33 67.82,28.42 68.33,27.91 69.17,27.91 69.84,28.59 77.75,28.59 85.66,36.5 U$3.SBWTCK
N$4
  Top 0.203: BLK1.SBWTDIO 68.32,29.33 68.32,28.5 68.5,28.32 69,28.32 69.67,28.99 77.58,28.99 79.63,31.04 79.63,33.04 85.63,39.04 U$3.2
N$5
  Top 0.203: BLK1.P2.0_TXD 77.4,29.4 79,31 79,34 80.87,35.87 80.87,38.58 83.87,41.58 U$3.3
N$6
  Top 0.203: U$5.3 14.77,35.95 13.72,34.9 13.72,34.75 R6.2
N$7
  Top 0.203: U$3.4 84.13,44.12 80.13,40.12 80.13,36.53 74.84,31.25 BLK1.P2.1_RXD
N$8
  Top 0.203: U$3.7 83.87,51.74 79,46.87 79,36.54 74.71,32.25 BLK1.P3.4_GPIO_DEBUG
N$9
  Top 0.203: U$3.8 89.63,54.53 | U$3.8 89.5,54.41 D1.A | U$3.8 84.13,54.28 78.59,48.75 78.59,36.71 74.63,32.75 BLK1.P3.5_GPIO_DEBUG
N$10
  Top 0.203: R3.2 74.5,65.5 75.1,64.9 C1.1 75,64.5 74.5,64 73.9,64 R4.2
N$11
  Top 0.203: D1.C R2.2
N$12
  Top 0.203: BLK1.P1.0_A0 57.25,38.75 D2.A
N$13
  Top 0.203: BLK1.P1.1_A1 58.25,38.25 58,38 58,36 57,35 D3.A
N$14
  Top 0.203: D3.C R10.1
N$15
  Top 0.203: D2.C R9.1
PPT_VBAT
  Top 0.203: U$6.S3 21.31,39.7 20.5,40.51 19.63,40.51 18.92,39.8 R5.2
  Top 0.254: U2.P$3 | 42.72,36.22 C4.2 | U4.P$1
  Top 0.406: C11.2 41,63.16 | C4.2 42.43,39.35 41,40.79 41,63.16 | 41,63.16 41,65 43.5,67.5 61,67.5 63.5,70 63.5,73
  Top 0.508: U2.P$1
  Top 0.61: U2.P$3 44.07,34.87 45.98,34.87 U2.P$1 | 42.72,36.22 U2.P$3 | U4.P$1 46.56,62.02 46.56,60.12 U4.P$3 | U4.P$1 45.22,62.66 C11.2
  pour Top (no thermals): 23.97,39.4 23.97,41.4 21.47,41.4 21.47,39.4
  pour Top (no thermals): 17.5,80.5 73.5,80.5 73.5,91 83,91 83,72 29.5,72 29.5,39.5 22.5,39.5 20.5,44.5 17.5,45.5
SMT_OUT  (via drill 0.35)
  Top 0.203: BLK1.P4.0_GPIO 64.75,18.62 64.66,18.53 62.5,18.53 v62.5,18.81 | v62.5,15.82 62.5,5 62,4.5 57.52,4.5 JP1.3
  Bottom 0.203: v62.5,18.81 v62.5,15.82 62.5,15.5